# EAGLE schematic Mini Spectrometer LED Circuit (EAGLE 9.7.0)
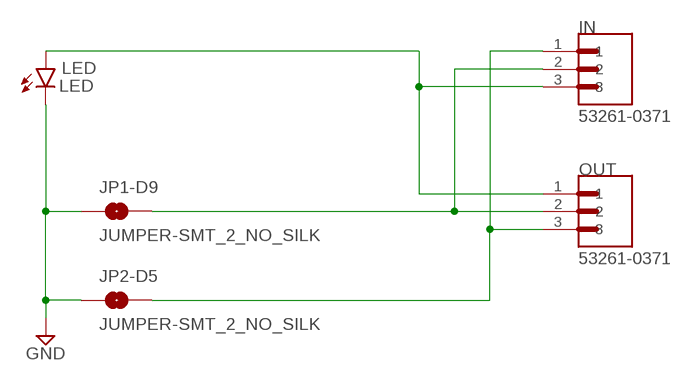
[diagram p0: schematic, sheet 1]

## Parts
IN  53261-0371  [MOLEX_53261-0371]
JP1-D9  JUMPER-SMT_2_NO_SILK  [SMT-JUMPER_2_NO_SILK]
JP2-D5  JUMPER-SMT_2_NO_SILK  [SMT-JUMPER_2_NO_SILK]
LED  LED  LED_RADIAL_WHITE  [LEDRD254W60D565H860B_W]
OUT  53261-0371  [MOLEX_53261-0371]

## Nets
GND: JP1-D9.1 JP2-D5.1 LED.2(C)
N$1: IN.3 LED.1(A) OUT.1
N$2: IN.2 JP1-D9.2 OUT.2
N$3: IN.1 JP2-D5.2 OUT.3

## Library data of the parts
IN OUT = 53261-0371:53261-0371: 1.25mm Pitch PicoBlade™ Header, Surface Mount, Right Angle, Lead-Free, 3 Circuits; MANUFACTURER: MOLEX
JP1-D9 JP2-D5 = SparkFun-Jumpers:JUMPER-SMT_2_NO: Normally open jumper This jumper has two pads in close proximity to each other. Apply solder to close the connection. Round pads are easier to solder for beginners, but are a lot larger. SparkFun Product that uses the round pads: SparkFun EL Sequencer <https://www.sparkfun.com/products/12781>
LED = Opto-Electronic:LED_RADIAL: LED - Generic; CATEGORY: Opto-Electronic; SUB-CATEGORY: LED; VALUE: LED_WHITE